# EAGLE design DigiIn1.1 (EAGLE 7.2.0)
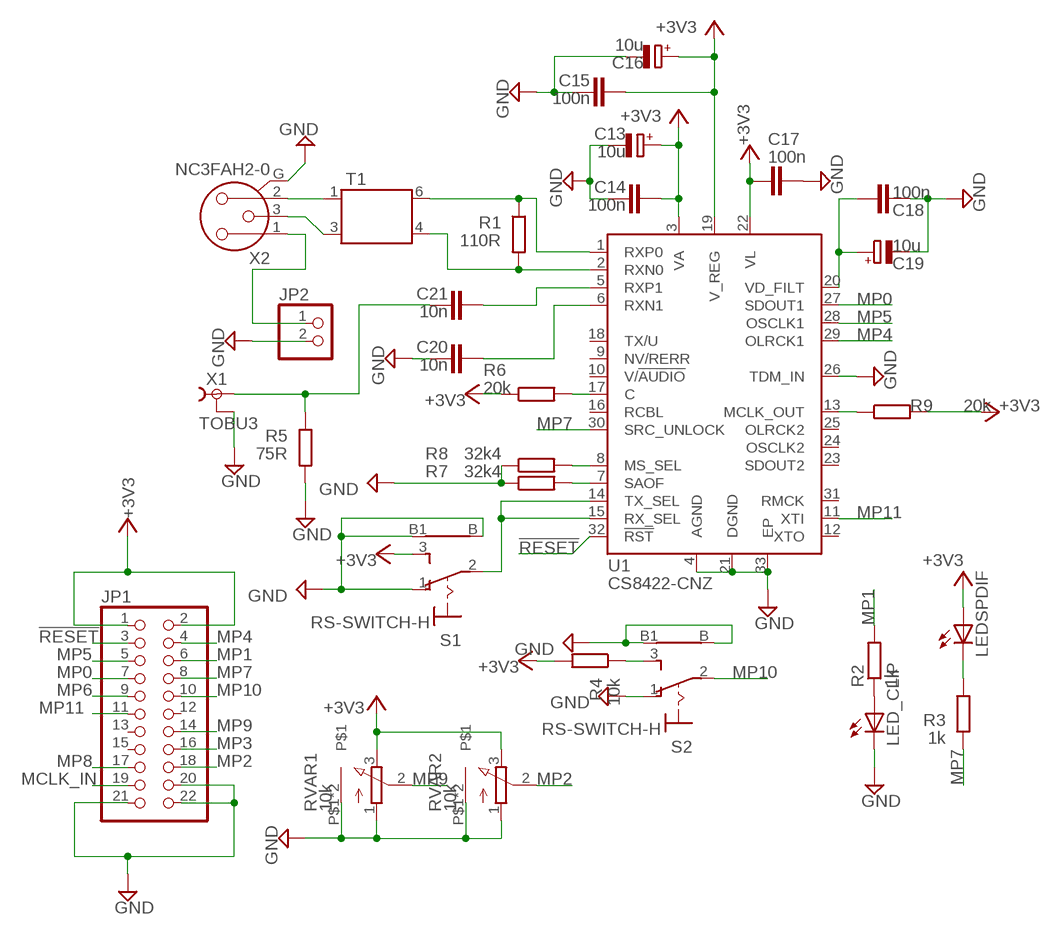
[diagram p0: schematic, sheet 1]

## Parts
C13  10u  CPOL-EUE2-5  [E2-5]
C14  100n  C-EU025-024X044  [C025-024X044]
C15  100n  C-EU025-024X044  [C025-024X044]
C16  10u  CPOL-EUE2-5  [E2-5]
C17  100n  C-EU025-024X044  [C025-024X044]
C18  100n  C-EU025-024X044  [C025-024X044]
C19  10u  CPOL-EUE2-5  [E2-5]
C20  10n  C-EU075-032X103  [C075-032X103]
C21  10n  C-EU075-032X103  [C075-032X103]
JP1  PINHD-2X11  [2X11]
JP2  PINHD-1X2  [1X02]
LED_CLIP  LED3MM  [LED3MM]
LEDSPDIF  LED3MM  [LED3MM]
R1  110R  R-EU_0207/10  [0207/10]
R2  1k  R-EU_0207/10  [0207/10]
R3  1k  R-EU_0207/10  [0207/10]
R4  10k  R-EU_0207/10  [0207/10]
R5  75R  R-EU_0207/2V  [0207/2V]
R6  20k  R-EU_0207/10  [0207/10]
R7  32k4  R-EU_0207/10  [0207/10]
R8  32k4  R-EU_0207/10  [0207/10]
R9  20k  R-EU_0207/10  [0207/10]
RVAR1  10k  ALPS-RK09  [ALPS-RK09]
RVAR2  10k  ALPS-RK09  [ALPS-RK09]
S1  RS-SWITCH-H  [RS-SWITCH-H]
S2  RS-SWITCH-H  [RS-SWITCH-H]
T1  TRAFO_DIL6  [TRAFO_DIL6]
U1  CS8422-CNZ  CS8422  [QFN50P500X500X100-33N]
X1  TOBU3  [TOBU3]
X2  NC3FAH2-0  [NC3FAH2-0]

## Nets
!RESET!: JP1.3 U1.32(!RST!)
+3V3 [VDD]: C13.+ C14.1 C15.1 C16.+ C17.1 JP1.1 JP1.2 LEDSPDIF.A R4.2 R6.1 R9.2 RVAR1.3 RVAR2.3 S1.3 U1.3(VA) U1.19(V_REG) U1.22(VL)
GND: C13.- C14.2 C15.2 C16.- C17.2 C18.2 C19.- C20.2 JP1.20 JP1.21 JP1.22 JP2.2 LED_CLIP.K(C) R5.2 R7.1 R8.1 RVAR1.1 RVAR1.P$1 RVAR1.P$2 RVAR2.1 RVAR2.P$1 RVAR2.P$2 S1.1 S1.B S1.B1 S2.1 S2.B S2.B1 U1.4(AGND) U1.21(DGND) U1.26(TDM_IN) U1.33(EP) X1.2 X1.2@1 X1.2@2 X2.G
MCLK_IN: JP1.19
MP0: JP1.7 U1.27(SDOUT1)
MP1: JP1.6 R2.2
MP2: JP1.18 RVAR2.2
MP3: JP1.16
MP4: JP1.4 U1.29(OLRCK1)
MP5: JP1.5 U1.28(OSCLK1)
MP6: JP1.9
MP7: JP1.8 R3.1 U1.30(SRC_UNLOCK)
MP8: JP1.17
MP9: JP1.14 RVAR1.2
MP10: JP1.10 S2.2
MP11: JP1.11 U1.11(XTI)
N$1: LED_CLIP.A R2.1
N$2: R1.1 T1.6 U1.1(RXP0)
N$3: C21.2 R5.1 X1.1
N$4: LEDSPDIF.K(C) R3.2
N$5: R1.2 T1.4 U1.2(RXN0)
N$6: T1.1 X2.2
N$7: T1.3 X2.3
N$8: S1.2 U1.14(TX_SEL) U1.15(RX_SEL)
N$9: C18.1 C19.+ U1.20(VD_FILT)
N$10: R4.1 S2.3
N$11: JP2.1 X2.1
N$14: C20.1 U1.6(RXN1)
N$15: C21.1 U1.5(RXP1)
N$16: R6.2 U1.17(C)
N$17: R7.2 U1.7(SAOF)
N$18: R8.2 U1.8(MS_SEL)
N$19: R9.1 U1.13(MCLK_OUT)
Unconnected: JP1.12 JP1.13 JP1.15 U1.9(NV/RERR) U1.10(V/!AUDIO!) U1.12(XTO) U1.16(RCBL) U1.18(TX/U) U1.23(SDOUT2) U1.24(OSCLK2) U1.25(OLRCK2) U1.31(RMCK)

## Library data of the parts
C13 C16 C19 = rcl:CPOL-EU: POLARIZED CAPACITOR, European symbol
C14 C15 C17 C18 C20 C21 = rcl:C-EU: CAPACITOR, European symbol
JP1 = pinhead:PINHD-2X11: PIN HEADER
JP2 = pinhead:PINHD-1X2: PIN HEADER
LED_CLIP LEDSPDIF = led:LED: LED OSRAM: - CHIPLED LG R971, LG N971, LY N971, LG Q971, LY Q971, LO R971, LY R971 LH N974, LH R974 LS Q976, LO Q976, LY Q976 LO Q996 - Hyper CHIPLED LW Q18S LB Q993, LB Q99A, LB R99A - SideLED LS A670, LO A670, LY A670, LG A670, LP A670 LB A673, LV A673, LT A673, LW A673 LH A674 LY A675 LS A676, LA A676, LO A676, LY A676, LW A676 LS A679, LY A679, LG A679 - Hyper Micro SIDELED® LS Y876, LA Y876, LO Y876, LY Y876 LT Y87S - SmartLED LW L88C, LW L88S LB L89C, LB L89S, LG L890 LS L89K, LO L89K, LY L89K LS L896, LA L896, LO L896, LY L896 - TOPLED LS T670, LO T670, LY T670, LG T670, LP T670 LSG T670, LSP T670, LSY T670, LOP T670, LYG T670 LG T671, LOG T671, LSG T671 LB T673, LV T673, LT T673, LW T673 LH T674 LS T676, LA T676, LO T676, LY T676, LB T676, LH T676, LSB T676, LW T676 LB T67C, LV T67C, LT T67C, LS T67K, LO T67K, LY T67K, LW E67C LS E67B, LA E67B, LO E67B, LY E67B, LB E67C, LV E67C, LT E67C LW T67C LS T679, LY T679, LG T679 LS T770, LO T770, LY T770, LG T770, LP T770 LB T773, LV T773, LT T773, LW T773 LH T774 LS E675, LA E675, LY E675, LS T675 LS T776, LA T776, LO T776, LY T776, LB T776 LHGB T686 LT T68C, LB T68C - Hyper Mini TOPLED® LB M676 - Mini TOPLED Santana® LG M470 LS M47K, LO M47K, LY M47K Source: http://www.osram.convergy.de LUXEON: - LUMILED® LXK2-PW12-R00, LXK2-PW12-S00, LXK2-PW14-U00, LXK2-PW14-V00 LXK2-PM12-R00, LXK2-PM12-S00, LXK2-PM14-U00 LXK2-PE12-Q00, LXK2-PE12-R00, LXK2-PE12-S00, LXK2-PE14-T00, LXK2-PE14-U00 LXK2-PB12-K00, LXK2-PB12-L00, LXK2-PB12-M00, LXK2-PB14-N00, LXK2-PB14-P00, LXK2-PB14-Q00 LXK2-PR12-L00, LXK2-PR12-M00, LXK2-PR14-Q00, LXK2-PR14-R00 LXK2-PD12-Q00, LXK2-PD12-R00, LXK2-PD12-S00 LXK2-PH12-R00, LXK2-PH12-S00 LXK2-PL12-P00, LXK2-PL12-Q00, LXK2-PL12-R00 Source: www.luxeon.com KINGBRIGHT: KA-3528ASYC Source: www.kingbright.com
R1-R9 = rcl:R-EU_: RESISTOR, European symbol
RVAR1 RVAR2 = alps-rk09:ALPS-RK09
S1 S2 = rs-switch:RS-SWITCH-H
T1 = murata-da:TRAFO_DIL6
U1 = AudioBlox:CS8422
X1 = con-hirschmann:TOBU3: Female Cinch CONNECTOR ( RCA Jack ); MF: FARNELL; MPN: TOBU 3; OC_FARNELL: 592791; OC_NEWARK: 06WX5914
X2 = con-neutrik_ag:NC3: Neutrik Audio Connector XLR SERIES Stereo 1/4" jack Source: www.neutrik.com/; MPN: NC3FAH-2-0; OC_FARNELL: unknown; OC_NEWARK: 11J5829

## Net classes
0 default: width 0.2 mm
1 VDD: width 0.3 mm

## Board
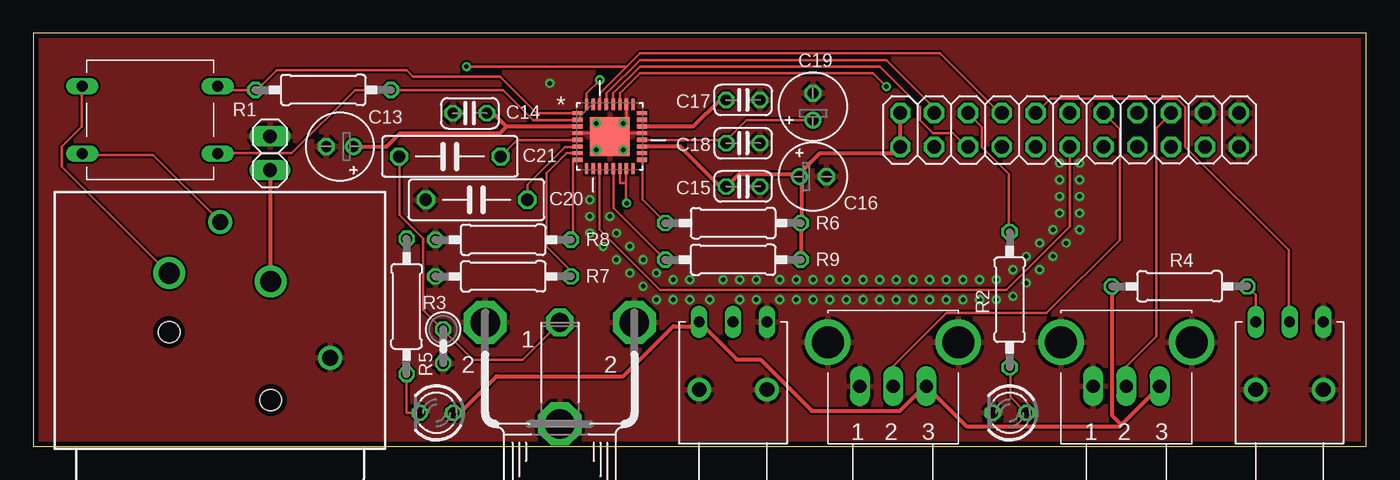
[diagram p1: board, top side]
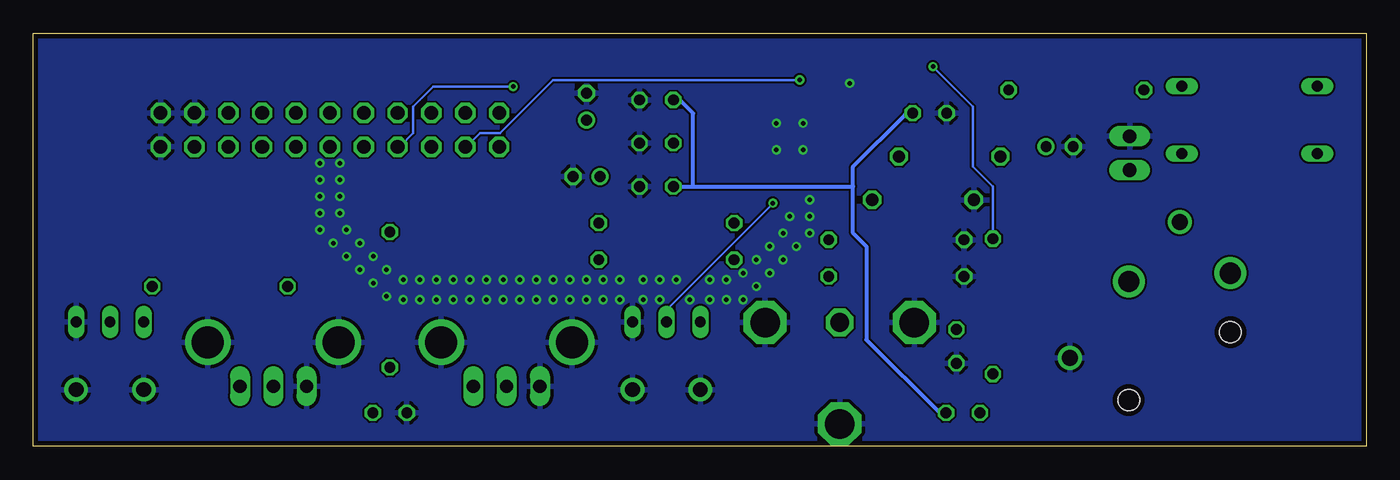
[diagram p2: board, bottom side, seen from below]

Size 100 x 31 mm. Coordinates in mm from the lower left corner, seen from the top.
Outline: 0,0 100,0 100,31 0,31 0,0
Copper layers (1*16): Top 0.0356mm / dielectric 1.5011mm / Bottom 0.0356mm
Design rules "LaenPCBOrder *": minimum track width 6mil, minimum drill 13mil, track to track 6mil, track to pad 6mil, pad to pad 6mil, via to via 6mil, smd to smd 6mil, copper to edge 15mil, drill to drill 6mil, minimum pad ring 7mil, minimum via ring 7mil, stop-mask expansion 3mil, vias tented up to drill 13mil, thermal gap 10mil

### Footprints (pad centres in the part's own frame; a part is rotated, then mirrored left to right if it is on the bottom)
E2-5 = drill 0.813 pad 1.27: + -1.016,0 | drill 0.813 pad 1.27 octagon: - 1.016,0
C025-024X044 = drill 0.813 octagon: 1 -1.27,0; 2 1.27,0
C075-032X103 = drill 0.914 octagon: 1 -3.81,0; 2 3.81,0
2X11 = drill 1.016 octagon: 1 -12.7,-1.27; 2 -12.7,1.27; 3 -10.16,-1.27; 4 -10.16,1.27; 5 -7.62,-1.27; 6 -7.62,1.27; 7 -5.08,-1.27; 8 -5.08,1.27; 9 -2.54,-1.27; 10 -2.54,1.27; 11 0,-1.27; 12 0,1.27; 13 2.54,-1.27; 14 2.54,1.27; 15 5.08,-1.27; 16 5.08,1.27; 17 7.62,-1.27; 18 7.62,1.27; 19 10.16,-1.27; 20 10.16,1.27; 21 12.7,-1.27; 22 12.7,1.27
1X02 = drill 1.016 long: 1 -1.27,0; 2 1.27,0
LED3MM = drill 0.813 octagon: A -1.27,0; K 1.27,0
0207/10 = drill 0.813 octagon: 1 -5.08,0; 2 5.08,0
0207/2V = drill 0.813 octagon: 1 -1.27,0; 2 1.27,0
ALPS-RK09 = drill 1 long: 1 -2.5,0; 2 0,0; 3 2.5,0 | drill 2.4: P$1 -4.9,3.3; P$2 4.9,3.3
RS-SWITCH-H = drill 0.813 long: 1 5.08,-2.54; 2 5.08,0; 3 5.08,2.54 | drill 1.118 pad 1.778: B 0,-2.54; B1 0,2.54
TRAFO_DIL6 = drill 0.813 long: 1 -5.08,2.54; 3 -5.08,-2.54; 4 5.08,-2.54; 6 5.08,2.54
QFN50P500X500X100-33N = smd 0.813 x 0.305: 1 -2.413,1.753; 2 -2.413,1.245; 3 -2.413,0.762; 4 -2.413,0.254; 5 -2.413,-0.254; 6 -2.413,-0.762; 7 -2.413,-1.245; 8 -2.413,-1.753; 17 2.413,-1.753; 18 2.413,-1.245; 19 2.413,-0.762; 20 2.413,-0.254; 21 2.413,0.254; 22 2.413,0.762; 23 2.413,1.245; 24 2.413,1.753 | smd 0.305 x 0.813: 9 -1.753,-2.413; 10 -1.245,-2.413; 11 -0.762,-2.413; 12 -0.254,-2.413; 13 0.254,-2.413; 14 0.762,-2.413; 15 1.245,-2.413; 16 1.753,-2.413; 25 1.753,2.413; 26 1.245,2.413; 27 0.762,2.413; 28 0.254,2.413; 29 -0.254,2.413; 30 -0.762,2.413; 31 -1.245,2.413; 32 -1.753,2.413 | smd 2.946 x 2.946: 33 0,0
TOBU3 = drill 1.397 octagon: 1 0,-2.54 | drill 2.21 octagon: 2 5.588,-2.54; 2@1 -5.588,-2.54; 2@2 0,5.08
NC3FAH2-0 = drill 1.6: 1 -3.81,0.635; 2 3.81,0 | drill 1.2: 3 0,-3.815; G -8.25,6.355 | hole 1.6: -3.81,9.525; 3.81,4.445

### Placement (x,y rotation side)
C13  23,22.5 180 top
C14  32.75,25 180 top
C15  53.25,19.5 0 top
C16  58.5,20.25 0 top
C17  53.25,26 0 top
C18  53.25,22.75 0 top
C19  58.5,25.5 90 top
C20  33.25,18.5 180 top
C21  31.25,21.75 180 top
JP1  77.75,23.75 0 top
JP2  17.75,22 90 top
LED_CLIP  73.25,2.5 180 top
LEDSPDIF  30.25,2.5 180 top
R1  21.75,26.75 0 top
R2  73.25,11 90 top
R3  28,10.5 270 top
R4  86,12 180 top
R5  30.75,7.5 270 top
R6  52.5,16.75 180 top
R7  35.25,12.75 0 top
R8  35.25,15.5 0 top
R9  52.5,14 0 top
RVAR1  64.5,4.5 0 top
RVAR2  82,4.5 0 top
S1  52.5,4.25 90 top
S2  94.25,4.25 90 top
T1  8.75,24.5 0 top
U1  43.25,23.25 0 top
X1  39.5,6.75 180 top
X2  14,13 180 top

### Tracks (layer width: path | path; a pad name or v marks a point on that pad's centre or on a via)
!RESET!  (via drill 0.33)
  Top 0.2: v42.5,27.5 41.5,26.5 41.5,26 U1.32
  Bottom 0.2: v42.5,27.5 61,27.5 65,23.5 66.5,23.5 67.5,22.5 JP1.3
+3V3
  Top 0.3: U1.22 46,24 49.5,24 51.5,26 C17.1 | U1.19 46,22.5 48.5,22.5 51.5,19.5 C15.1 52.07,19.56 52.95,20.44 57.35,20.44 C16.+ | JP1.2 65,25 65,22.5 JP1.1 65,22 59,22 57.5,20.5 C16.+ | C13.+ 26.5,22.5 27.5,23.5 35,23.5 35.5,24 | 35.5,24 34.55,24.95 C14.1 | U1.3 35.51,24.01 35.5,24 | LEDSPDIF.A 32,2.5 34.75,5.25 44.25,5.25 48,9 49.5,9 S1.3 50.04,9.25 52.79,6.5 54.55,6.5 58.41,2.64 65.02,2.64 66.87,4.49 RVAR1.3 70,1.5 81.5,1.5 81.62,1.62 | R9.2 57.62,14.01 57.62,16.74 R6.1 57.62,16.83 57.62,20.18 C16.+ | 81.62,1.62 RVAR2.3 | R4.2 80.92,2.33 81.62,1.62
  Bottom 0.3: LEDSPDIF.A 32,2.5 37.5,8 37.5,15 38.5,16 38.5,19.5 | 50.5,19.5 50.5,25 51.5,26 C17.1 | C15.1 50.5,19.5 | 50.5,19.5 38.5,19.5 | 38.5,19.5 38.5,21 34.62,24.88 34.15,24.88 C14.1
GND  (via drill 0.33)
  Top 0.2: 44.5,25.5 44.49,25.72 | 44.5,25.5 44.5,24.5 v44.25,24.25 43.88,23.88 U1.33 | 44.5,25.5 U1.26 | U1.4 42.25,23.5 | U1.21 43.88,23.5
  Top 0.3: 42.25,23.5 v42.25,24.25 | 43.88,23.5 43.88,23.88
  other vias: 42.25,22.25 44.25,22.25 38.75,27.25 78.5,21.25 78.5,20 78.5,18.75 78.5,17.5 78.5,16.25 77.5,15.25 76.5,14.25 75.5,13.25 74.5,12.25 73.5,11.25 72.25,11 71,11 69.75,11 68.5,11 67.25,11 66,11 64.75,11 63.5,11 62.25,11 61,11 59.75,11 58.5,11 57.25,11 56,11 53,11 54.25,11 50.75,11 49.25,11 48,11 46.75,11 45.75,12 44.75,13 43.75,14 42.75,15 41.75,16 41.75,17.25 41.75,18.5 43.25,17.25 43.75,16 44.75,15 45.75,14 46.75,13 48,12.5 49.25,12.5 51.75,12.5 53,12.5 54.25,12.5 57.25,12.5 56,12.5 58.5,12.5 59.75,12.5 61,12.5 62.25,12.5 63.5,12.5 64.75,12.5 66,12.5 67.25,12.5 68.5,12.5 69.75,12.5 71,12.5 72.25,12.5 73.5,13.25 74.5,14.25 75.5,15.25 76.5,16.25 77,17.5 77,18.75 77,20 77,21.25
  pour Bottom: -2.54,-2.54 105.17,-2.79 105.17,32.28 -2.54,32.53
  pour Top: -3.81,-3.81 106.69,-3.81 106.94,34.05 -3.56,34.05
MP0  (via drill 0.33)
  Top 0.2: v64,27 63,28 45.5,28 44,26.5 44,26 U1.27
  Bottom 0.2: v64,27 70,27 71.5,25.5 71.5,23.5 72.5,22.5 JP1.7
MP1
  Top 0.2: R2.2 73.21,16.12 73.21,20.44 71.19,22.46 71.19,23.96 70.22,24.93 JP1.6
MP2
  Top 0.2: RVAR2.2 82,6 84.25,8.25 84.25,23.9 JP1.18
MP4
  Top 0.2: U1.29 43,26 43,26.5 45.5,29 64,29 67.5,25.5 JP1.4
MP5
  Top 0.2: U1.28 43.5,26 43.5,26.5 45.5,28.5 63.5,28.5 66.5,25.5 66.5,24.5 67.5,23.5 69,23.5 70,22.5 JP1.5
MP7  (via drill 0.33)
  Top 0.2: 44.5,28.5 45.5,29.5 68,29.5 72.5,25 JP1.8 | 44.5,28.5 42.5,26.5 42.5,26 U1.30 | 44.5,28.5 v32.5,28.5
  Bottom 0.2: v32.5,28.5 29.5,25.5 29.5,21 28,19.5 R3.1
MP9
  Top 0.2: RVAR1.2 64.5,6 68.5,10 76,10 81.5,15.5 81.5,23.81 JP1.14
MP10
  Top 0.2: S2.2 94.18,9.34 94.18,14.71 86.43,22.46 86.43,25.46 85.81,26.08 76.3,26.08 75.24,25.02 JP1.10
MP11
  Top 0.2: U1.11 42.49,16.26 47,11.75 73,11.75 77.75,16.5 JP1.11
N$1
  Top 0.2: R2.1 73.3,5.9 73.3,3.7 74.44,2.56 LED_CLIP.A
N$2
  Top 0.2: U1.1 40.75,25 37.75,25 35,27.75 28.5,27.75 28,28.25 18.25,28.25 17,27 R1.1 13.88,26.75 T1.6
N$3
  Top 0.2: C21.2 27.49,21.67 27.49,17.36 29.25,15.59 29.25,10.22 30.66,8.81 R5.1 30.75,8.75 33,6.5 36.71,6.5 X1.1
N$4
  Top 0.2: R3.2 28,2.5 LEDSPDIF.K
N$5
  Top 0.2: U1.2 40.5,24.5 37.5,24.5 35.25,26.75 R1.2 24.12,26.75 19.38,22 14.12,22 T1.4
N$6
  Top 0.2: T1.1 3.62,26.75 3.62,24 2.12,22.5 2.12,21 10.12,13 X2.2
N$7
  Top 0.2: T1.3 3.5,21.88 9,21.88 14,16.88 X2.3
N$8  (via drill 0.33)
  Top 0.2: 44.48,19.75 44.48,18.29 v44.52,18.25 | 44.48,19.75 44.48,20.89 U1.15 | U1.14 44,19.75 44.48,19.75
  Bottom 0.2: 52.42,9.34 S1.2 52.5,10.25 44.52,18.23 v44.52,18.25
N$9
  Top 0.2: U1.20 46,23 51.5,23 C18.1 52,23 53.5,24.5 58.5,24.5 C19.+
N$10
  Top 0.2: S2.3 91.71,11.37 R4.1
N$11
  Top 0.3: X2.1 17.81,20.67 JP2.1
N$14
  Top 0.2: U1.6 40.79,22.46 39.91,22.46 37.09,19.65 37.09,18.5 C20.1
N$15
  Top 0.2: U1.5 40.79,22.99 36.3,22.99 C21.1
N$16
  Top 0.2: U1.17 45.72,21.5 45.72,18.5 47.4,16.83 R6.2
N$17
  Top 0.2: U1.7 40.5,22 40,22 38.5,20.5 38.5,15 40.5,13 R7.2
N$18
  Top 0.2: U1.8 40.5,21.5 40.5,15.5 R8.2
N$19
  Top 0.2: U1.13 43.52,20.79 43.52,17.88 47.4,14.01 R9.1